# EAGLE design 7s_BMS_V1-1 (EAGLE 9.6.2)
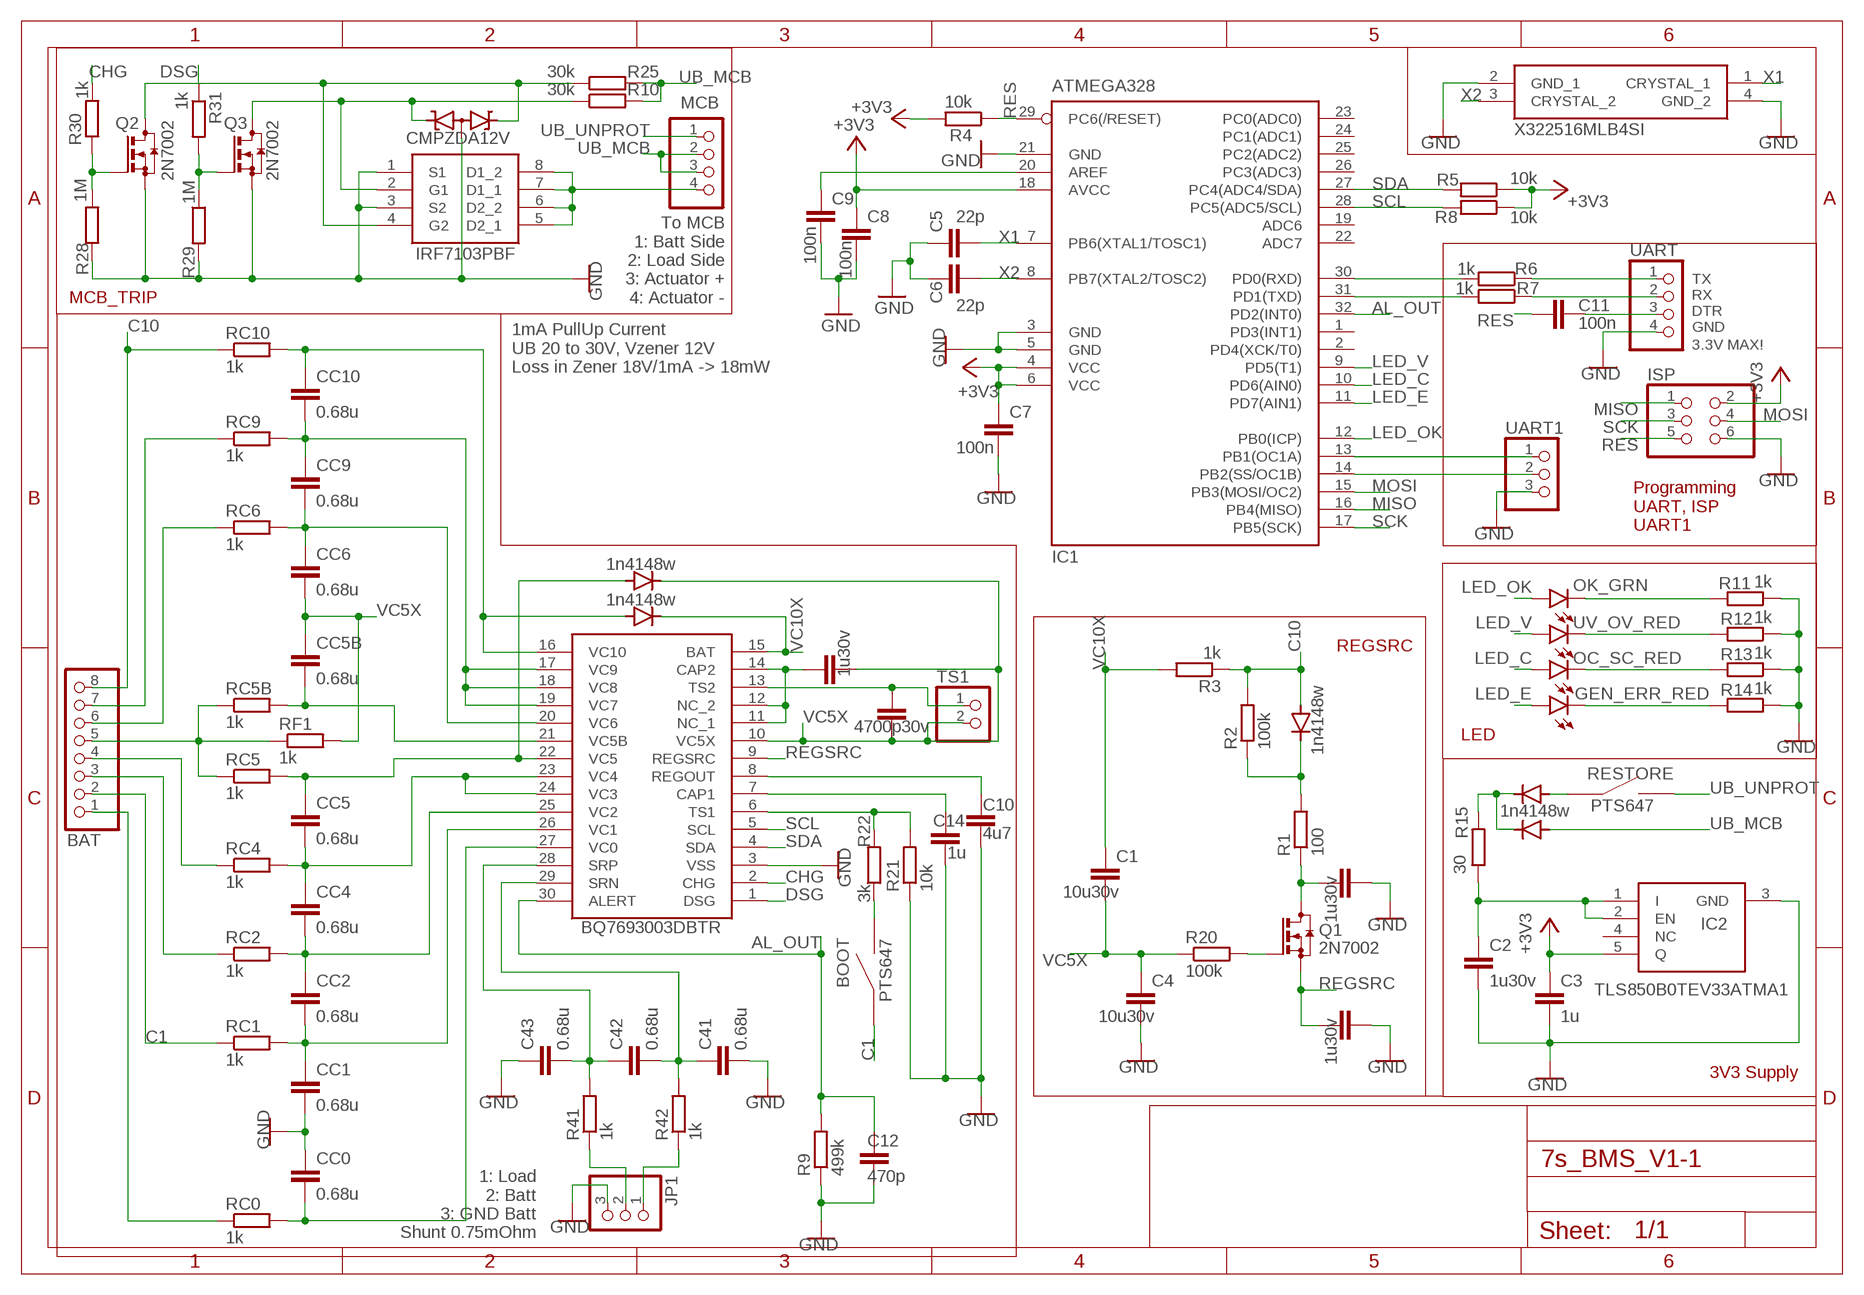
[diagram p0: schematic, sheet 1]

## Parts
BAT  PINHD-1X8/90  [1X08/90]
C1  10u30v  C-EUC0805  [C0805]
C2  1u30v  C-EUC0805  [C0805]
C3  1u  C-EUC0603  [C0603]
C4  10u30v  C-EUC0805  [C0805]
C5  22p  C-EUC0603  [C0603]
C6  22p  C-EUC0603  [C0603]
C7  100n  C-EUC0603  [C0603]
C8  100n  C-EUC0603  [C0603]
C9  100n  C-EUC0603  [C0603]
C10  4u7  C-EUC0805  [C0805]
C11  100n  C-EUC0603  [C0603]
C12  470p  C-EUC0603  [C0603]
C14  1u  C-EUC0603  [C0603]
C30  1u30v  C-EUC0603  [C0603]
C31  1u30v  C-EUC0603  [C0603]
C41  0.68u  C-EUC0603  [C0603]
C42  0.68u  C-EUC0603  [C0603]
C43  0.68u  C-EUC0603  [C0603]
C61  1u30v  C-EUC0603  [C0603]
C62  4700p30v  C-EUC0603  [C0603]
CC0  0.68u  C-EUC0603  [C0603]
CC1  0.68u  C-EUC0603  [C0603]
CC2  0.68u  C-EUC0603  [C0603]
CC4  0.68u  C-EUC0603  [C0603]
CC5  0.68u  C-EUC0603  [C0603]
CC5B  0.68u  C-EUC0603  [C0603]
CC6  0.68u  C-EUC0603  [C0603]
CC9  0.68u  C-EUC0603  [C0603]
CC10  0.68u  C-EUC0603  [C0603]
D1  1n4148w  DIODE-SOD123  [SOD123]
D2  1n4148w  DIODE-SOD123  [SOD123]
D3  1n4148w  DIODE-SOD123  [SOD123]
D4  1n4148w  DIODE-SOD123  [SOD123]
D5  1n4148w  DIODE-SOD123  [SOD123]
GEN_ERR_RED  KT-0603R  LEDCHIP-LED0603  [CHIP-LED0603]
IC1  ATMEGA328  MEGA8-AI  [TQFP32-08]
IC2  TLS850B0TEV33ATMA1  [BTS6143D]
IC3  BQ7693003DBTR  [SOP50P640X120-30N]
ISP  PINHD-2X3  [2X03]
JP1  PINHD-1X3/90  [1X03/90]
MCB  PINHD-1X4  [1X04]
OC_SC_RED  KT-0603R  LEDCHIP-LED0603  [CHIP-LED0603]
OK_GRN  19-217/GHC-YR1S2/3T  LEDCHIP-LED0603  [CHIP-LED0603]
Q1  2N7002  BSS123  [SOT23]
Q2  2N7002  BSS123  [SOT23]
Q3  2N7002  BSS123  [SOT23]
Q4  IRF7103PBF  [SOIC127P600X175-8N]
R1  100  R-EU_R0603  [R0603]
R2  100k  R-EU_R0603  [R0603]
R3  1k  R-EU_R0603  [R0603]
R4  10k  R-EU_R0603  [R0603]
R5  10k  R-EU_R0603  [R0603]
R6  1k  R-EU_R0603  [R0603]
R7  1k  R-EU_R0603  [R0603]
R8  10k  R-EU_R0603  [R0603]
R9  499k  R-EU_R0603  [R0603]
R10  30k  R-EU_R0603  [R0603]
R11  1k  R-EU_R0603  [R0603]
R12  1k  R-EU_R0603  [R0603]
R13  1k  R-EU_R0603  [R0603]
R14  1k  R-EU_R0603  [R0603]
R15  30  R-EU_R0805  [R0805]
R20  100k  R-EU_R0603  [R0603]
R21  10k  R-EU_R0603  [R0603]
R22  3k  R-EU_R0603  [R0603]
R25  30k  R-EU_R0603  [R0603]
R28  1M  R-EU_R0603  [R0603]
R29  1M  R-EU_R0603  [R0603]
R30  1k  R-EU_R0603  [R0603]
R31  1k  R-EU_R0603  [R0603]
R41  1k  R-EU_R0603  [R0603]
R42  1k  R-EU_R0603  [R0603]
RC0  1k  R-EU_R0603  [R0603]
RC1  1k  R-EU_R0603  [R0603]
RC2  1k  R-EU_R0603  [R0603]
RC4  1k  R-EU_R0603  [R0603]
RC5  1k  R-EU_R0603  [R0603]
RC5B  1k  R-EU_R0603  [R0603]
RC6  1k  R-EU_R0603  [R0603]
RC9  1k  R-EU_R0603  [R0603]
RC10  1k  R-EU_R0603  [R0603]
RF1  1k  R-EU_R0603  [R0603]
TS1  PINHD-1X2/90  [1X02/90]
U$1  PTS647  [PTS647]
U$2  PTS647  [PTS647]
U$3  CMPZDA12V  [SOT23]
UART  PINHD-1X4  [1X04]
UART1  PINHD-1X3  [1X03]
UV_OV_RED  KT-0603R  LEDCHIP-LED0603  [CHIP-LED0603]
Y1  X322516MLB4SI  [X322516MLB4SI]

## Nets
+3V3: C3.1 C7.1 C8.1 IC1.4(VCC) IC1.6(VCC) IC1.18(AVCC) IC2.5(Q) ISP.2 R4.2 R5.1 R8.1
A: BAT.5 RC5.1 RC5B.1 RF1.1
AL_OUT: C12.1 IC1.32(PD2(INT0)) IC3.30(ALERT) R9.2
C1: BAT.2 RC1.1 U$2.1 U$2.2
C10: BAT.8 D5.A R2.2 R3.1 RC10.1
CHG: IC3.2(CHG) R30.2
DSG: IC3.1(DSG) R31.1
GND: C2.2 C3.2 C4.2 C5.1 C6.1 C7.2 C8.2 C9.2 C10.2 C12.2 C14.2 C30.1 C31.1 C41.2 C43.1 CC0.1 CC1.2 IC1.3(GND) IC1.5(GND) IC1.21(GND) IC2.3(GND) IC3.3(VSS) ISP.6 JP1.3 Q2.2(S) Q3.2(S) Q4.1(S1) Q4.3(S2) R9.1 R11.1 R12.1 R13.1 R14.1 R21.1 R28.1 R29.2 U$3.3(A) UART1.3 UART.4 Y1.2(GND_1) Y1.4(GND_2)
LED_C: IC1.10(PD6(AIN0)) OC_SC_RED.A
LED_E: GEN_ERR_RED.A IC1.11(PD7(AIN1))
LED_OK: IC1.12(PB0(ICP)) OK_GRN.A
LED_V: IC1.9(PD5(T1)) UV_OV_RED.A
MISO: IC1.16(PB4(MISO)) ISP.1
MOSI: IC1.15(PB3(MOSI/OC2)) ISP.4
N$1: C2.1 IC2.1(I) IC2.2(EN) R15.1
N$2: CC10.1 D3.A IC3.16(VC10) RC10.2
N$3: D2.A U$1.1 U$1.2
N$4: C30.2 Q1.3(D) R1.1
N$5: CC0.2 IC3.27(VC0) RC0.2
N$6: C61.1 IC3.11(NC_1) IC3.12(NC_2) IC3.14(CAP2)
N$7: CC1.1 CC2.2 IC3.26(VC1) RC1.2
N$8: CC2.1 CC4.2 IC3.25(VC2) RC2.2
N$9: CC4.1 CC5.2 IC3.23(VC4) IC3.24(VC3) RC4.2
N$10: BAT.1 RC0.1
N$11: BAT.4 RC4.1
N$12: IC1.30(PD0(RXD)) R6.2
N$13: C9.1 IC1.20(AREF)
N$14: BAT.3 RC2.1
N$15: IC1.31(PD1(TXD)) R7.2
N$16: R6.1 UART.1
N$17: R7.1 UART.2
N$18: C11.2 UART.3
N$19: C42.1 C43.2 IC3.28(SRP) R41.2
N$20: CC5.1 D4.A IC3.22(VC5) RC5.2
N$21: CC5B.2 IC3.21(VC5B) RC5B.2
N$22: BAT.7 RC9.1
N$23: BAT.6 RC6.1
N$24: CC9.1 CC10.2 IC3.17(VC9) IC3.18(VC8) IC3.19(VC7) RC9.2
N$25: CC6.1 CC9.2 IC3.20(VC6) RC6.2
N$26: C62.2 IC3.13(TS2) TS1.1
N$27: Q1.1(G) R20.2
N$28: C10.1 IC3.8(REGOUT)
N$29: D5.C R1.2 R2.1
N$30: C14.1 IC3.7(CAP1)
N$31: IC3.6(TS1) R21.2 R22.2
N$32: R22.1 U$2.3 U$2.4
N$33: C41.1 C42.2 IC3.29(SRN) R42.2
N$34: JP1.2 R41.1
N$35: JP1.1 R42.1
N$36: Q2.1(G) R28.2 R30.1
N$37: Q3.1(G) R29.1 R31.2
N$38: MCB.4 Q4.5(D2_1) Q4.6(D2_2) Q4.7(D1_1) Q4.8(D1_2)
N$39: D1.C D2.C R15.2
N$40: Q3.3(D) Q4.2(G1) R10.1 U$3.1(K2)
N$41: GEN_ERR_RED.C R14.2
N$42: OC_SC_RED.C R13.2
N$43: R12.2 UV_OV_RED.C
N$44: OK_GRN.C R11.2
N$45: IC1.14(PB2(SS/OC1B)) UART1.2
N$46: IC1.13(PB1(OC1A)) UART1.1
REGSRC: C31.2 IC3.9(REGSRC) Q1.2(S)
RES: C11.1 IC1.29(PC6(/RESET)) ISP.5 R4.1
SCK: IC1.17(PB5(SCK)) ISP.3
SCL: IC1.28(PC5(ADC5/SCL)) IC3.5(SCL) R8.2
SDA: IC1.27(PC4(ADC4/SDA)) IC3.4(SDA) R5.2
TRIP_MCB: Q2.3(D) Q4.4(G2) R25.1 U$3.2(K1)
UB_MCB: D1.A MCB.2 MCB.3 R10.2 R25.2
UB_UNPROT: MCB.1 U$1.3 U$1.4
VC5X: C1.2 C4.1 C61.2 C62.1 CC5B.1 CC6.2 D4.C IC3.10(VC5X) R20.1 RF1.2 TS1.2
VC10X: C1.1 D3.C IC3.15(BAT) R3.2
X1: C5.2 IC1.7(PB6(XTAL1/TOSC1)) Y1.1(CRYSTAL_1)
X2: C6.2 IC1.8(PB7(XTAL2/TOSC2)) Y1.3(CRYSTAL_2)
Unconnected: IC1.1(PD3(INT1)) IC1.2(PD4(XCK/T0)) IC1.19(ADC6) IC1.22(ADC7) IC1.23(PC0(ADC0)) IC1.24(PC1(ADC1)) IC1.25(PC2(ADC2)) IC1.26(PC3(ADC3)) IC2.4(NC)

## Notes on the sheet
- MCB_TRIP
- To MCB
  1: Batt Side
  2: Load Side
  3: Actuator +
  4: Actuator -
- TX
  RX
  DTR
  GND
- 3.3V MAX!
- 1mA PullUp Current
  UB 20 to 30V, Vzener 12V
  Loss in Zener 18V/1mA -> 18mW
- Programming
  UART, ISP
  UART1
- REGSRC
- LED
- RESTORE
- BOOT
- 3V3 Supply
- 1: Load
  2: Batt
  3: GND Batt
  Shunt 0.75mOhm

## Library data of the parts
BAT = pinhead:PINHD-1X8: PIN HEADER
C1-C12 C14 C30 C31 C41-C43 C61 C62 CC0 CC1 CC2 CC4 CC5 CC5B CC6 CC9 CC10 = rcl:C-EU: CAPACITOR, European symbol; SPICEPREFIX: C
D1-D5 = diode:DIODE-: DIODE
GEN_ERR_RED OC_SC_RED OK_GRN UV_OV_RED = led:LED: LED OSRAM: - CHIPLED LG R971, LG N971, LY N971, LG Q971, LY Q971, LO R971, LY R971 LH N974, LH R974 LS Q976, LO Q976, LY Q976 LO Q996 - Hyper CHIPLED LW Q18S LB Q993, LB Q99A, LB R99A - SideLED LS A670, LO A670, LY A670, LG A670, LP A670 LB A673, LV A673, LT A673, LW A673 LH A674 LY A675 LS A676, LA A676, LO A676, LY A676, LW A676 LS A679, LY A679, LG A679 - Hyper Micro SIDELED® LS Y876, LA Y876, LO Y876, LY Y876 LT Y87S - SmartLED LW L88C, LW L88S LB L89C, LB L89S, LG L890 LS L89K, LO L89K, LY L89K LS L896, LA L896, LO L896, LY L896 - TOPLED LS T670, LO T670, LY T670, LG T670, LP T670 LSG T670, LSP T670, LSY T670, LOP T670, LYG T670 LG T671, LOG T671, LSG T671 LB T673, LV T673, LT T673, LW T673 LH T674 LS T676, LA T676, LO T676, LY T676, LB T676, LH T676, LSB T676, LW T676 LB T67C, LV T67C, LT T67C, LS T67K, LO T67K, LY T67K, LW E67C LS E67B, LA E67B, LO E67B, LY E67B, LB E67C, LV E67C, LT E67C LW T67C LS T679, LY T679, LG T679 LS T770, LO T770, LY T770, LG T770, LP T770 LB T773, LV T773, LT T773, LW T773 LH T774 LS E675, LA E675, LY E675, LS T675 LS T776, LA T776, LO T776, LY T776, LB T776 LHGB T686 LT T68C, LB T68C - Hyper Mini TOPLED® LB M676 - Mini TOPLED Santana® LG M470 LS M47K, LO M47K, LY M47K Source: http://www.osram.convergy.de LUXEON: - LUMILED® LXK2-PW12-R00, LXK2-PW12-S00, LXK2-PW14-U00, LXK2-PW14-V00 LXK2-PM12-R00, LXK2-PM12-S00, LXK2-PM14-U00 LXK2-PE12-Q00, LXK2-PE12-R00, LXK2-PE12-S00, LXK2-PE14-T00, LXK2-PE14-U00 LXK2-PB12-K00, LXK2-PB12-L00, LXK2-PB12-M00, LXK2-PB14-N00, LXK2-PB14-P00, LXK2-PB14-Q00 LXK2-PR12-L00, LXK2-PR12-M00, LXK2-PR14-Q00, LXK2-PR14-R00 LXK2-PD12-Q00, LXK2-PD12-R00, LXK2-PD12-S00 LXK2-PH12-R00, LXK2-PH12-S00 LXK2-PL12-P00, LXK2-PL12-Q00, LXK2-PL12-R00 Source: www.luxeon.com KINGBRIGHT: KA-3528ASYC Source: www.kingbright.com
IC1 = atmel:MEGA8: MICROCONTROLLER 8 Kbytes FLASH, 1 kbytes SRAM, 512 bytes EEPROM, USART, 6-channel 10 bit ADC, 2-channel 8 bit ADC Pin compatible with Atmega48, ATMega88, ATMega168 Source: avr.lbr; MPN: ATMEGA8-16AU; OC_FARNELL: 9171371; OC_NEWARK: 73M8863
IC2 = TLS850B0TEV33ATMA1:TLS850B0TEV33ATMA1: Linear Voltage Regulators LINEAR VOLTAGE REGULATOR Source: Datasheet <https://componentsearchengine.com/Datasheets/1/TLS850B0TEV33ATMA1.pdf>; ARROW_PART_NUMBER: TLS850B0TEV33ATMA1; ARROW_PRICE-STOCK: https://www.arrow.com/en/products/tls850b0tev33atma1/infineon-technologies-ag; DESCRIPTION: Linear Voltage Regulators LINEAR VOLTAGE REGULATOR; HEIGHT: 2mm; MANUFACTURER_NAME: Infineon; MANUFACTURER_PART_NUMBER: TLS850B0TEV33ATMA1; MOUSER_PART_NUMBER: 726-TLS850B0TEV33ATM; MOUSER_PRICE-STOCK: https://www.mouser.co.uk/ProductDetail/Infineon-Technologies/TLS850B0TEV33ATMA1/?qs=W0yvOO0ixfGvA2FkIMPoCw%3D%3D
IC3 = BQ7693003DBTR:BQ7693003DBTR: 6 to 10-Series Cell Li-Ion and Li-Phosphate Battery Monitor (bq76940 Family) Source: Datasheet <http://www.ti.com/lit/gpn/bq76930>; ARROW_PART_NUMBER: BQ7693003DBTR; ARROW_PRICE-STOCK: https://www.arrow.com/en/products/bq7693003dbtr/texas-instruments; DESCRIPTION: 6 to 10-Series Cell Li-Ion and Li-Phosphate Battery Monitor (bq76940 Family); HEIGHT: 1.2mm; MANUFACTURER_NAME: Texas Instruments; MANUFACTURER_PART_NUMBER: BQ7693003DBTR; MOUSER_PART_NUMBER: 595-BQ7693003DBTR; MOUSER_PRICE-STOCK: https://www.mouser.co.uk/ProductDetail/Texas-Instruments/BQ7693003DBTR?qs=%2Fd%252BFzHvH4c12hO1yCMa7%252Bw%3D%3D
ISP = pinhead:PINHD-2X3: PIN HEADER
JP1 UART1 = pinhead:PINHD-1X3: PIN HEADER
MCB UART = pinhead:PINHD-1X4: PIN HEADER
Q1-Q3 = transistor-small-signal:BSS123: N-CHANNEL MOS FET
Q4 = IRF7103PBF:IRF7103PBF: MOSFET Dual N-Channel 50V 3A SOIC8 International Rectifier IRF7103PBF Dual N-channel MOSFET Transistor, 3 A, 50 V, 8-Pin SOIC Source: Datasheet <http://www.infineon.com/dgdl/irf7103pbf.pdf?fileId=5546d462533600a4015355f0f0141ac6>; ARROW_PART_NUMBER: IRF7103PBF; DESCRIPTION: MOSFET Dual N-Channel 50V 3A SOIC8 International Rectifier IRF7103PBF Dual N-channel MOSFET Transistor, 3 A, 50 V, 8-Pin SOIC; HEIGHT: 1.75mm; MANUFACTURER_NAME: International Rectifier; MANUFACTURER_PART_NUMBER: IRF7103PBF
R1-R15 R20-R22 R25 R28-R31 R41 R42 RC0 RC1 RC2 RC4 RC5 RC5B RC6 RC9 RC10 RF1 = rcl:R-EU_: RESISTOR, European symbol; SPICEPREFIX: R
TS1 = pinhead:PINHD-1X2: PIN HEADER
U$1 U$2 = smd_taster:PTS647
U$3 = diode_zener_added:CMPZDA12V
Y1 = X322516MLB4SI:X322516MLB4SI: Crystal Source: Datasheet <https://datasheet.lcsc.com/szlcsc/Yangxing-Tech-X322516MLB4SI_C13738.pdf>; DESCRIPTION: Crystal; HEIGHT: 0.8mm; MANUFACTURER_NAME: Yangxing Tech; MANUFACTURER_PART_NUMBER: X322516MLB4SI

## Board
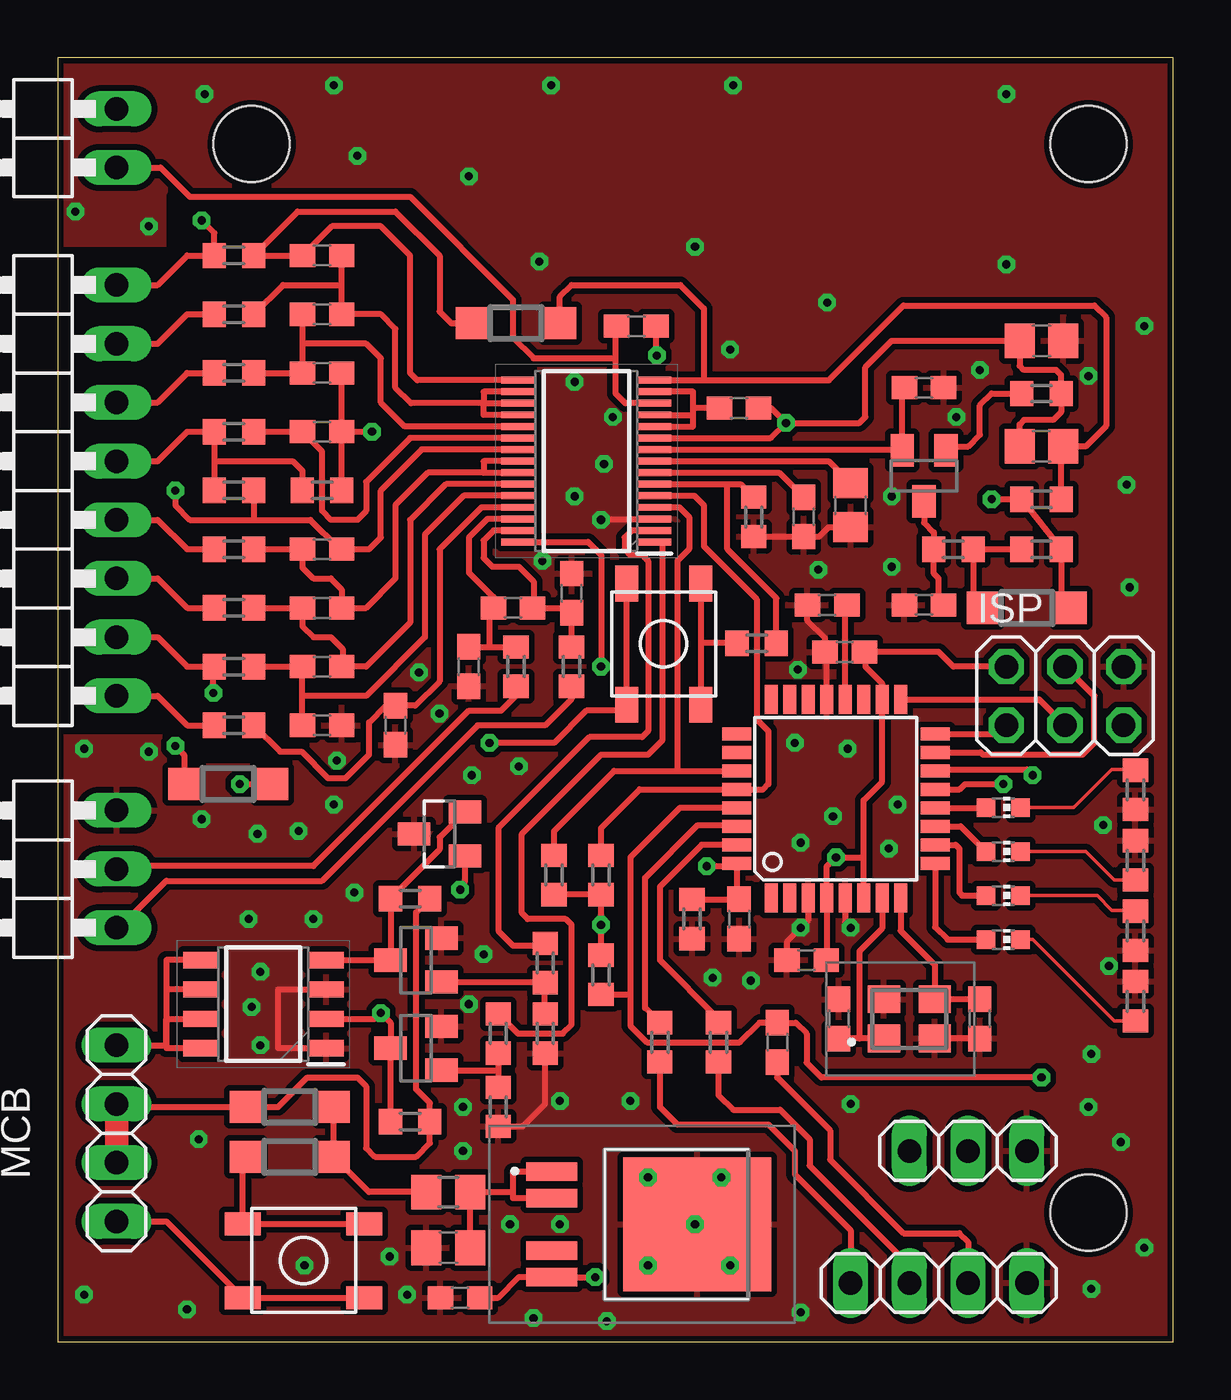
[diagram p1: board, top side]
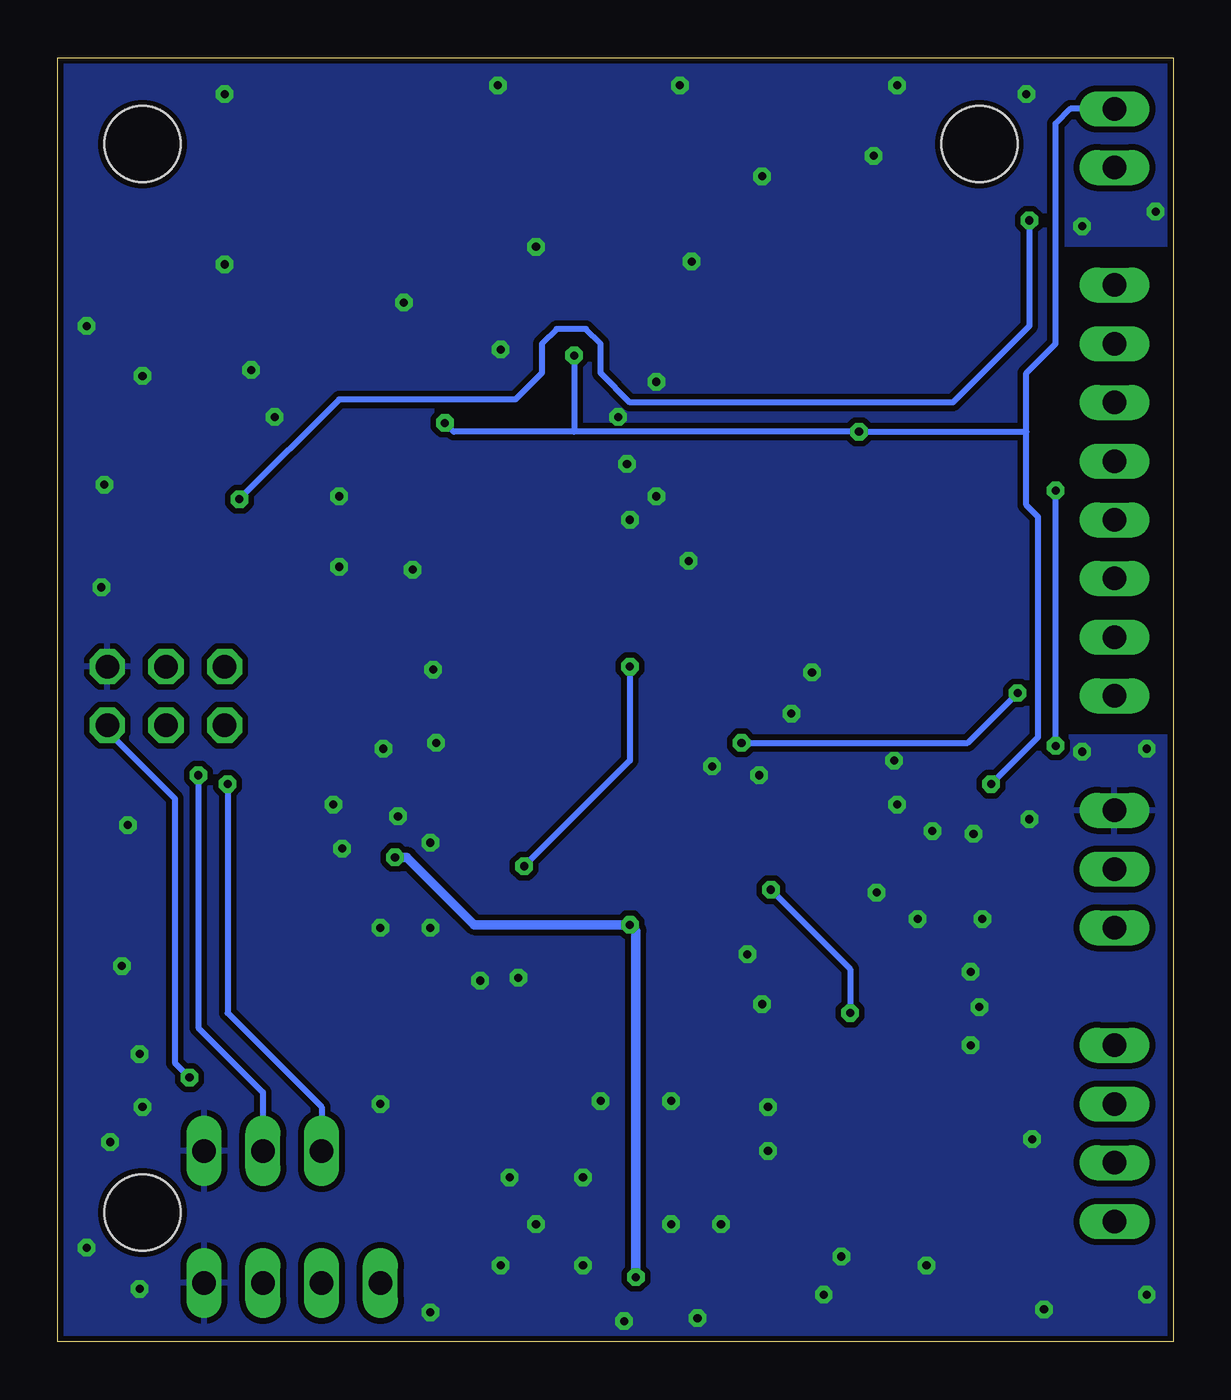
[diagram p2: board, bottom side, seen from below]

Size 48.24 x 55.55 mm. Coordinates in mm from the lower left corner, seen from the top.
Outline: 0,0 48.24,0 48.24,55.55 0,55.55 0,0
Copper layers (1*16): Top 0.035mm / dielectric 1.5mm / Bottom 0.035mm
Design rules "jlcpcb": minimum track width 3.5mil, minimum drill 0.2mm, track to track 3.5mil, track to pad 5mil, pad to pad 5mil, via to via 5mil, smd to smd 5mil, copper to edge 0.2mm, drill to drill 8mil, minimum pad ring 10mil, minimum via ring 8mil, stop-mask expansion 4mil, vias tented up to drill 0mil, thermal gap 10mil
Holes 3.3 mm at 44.58,51.82 8.38,51.82 44.58,5.59
tRestrict: area 0,25.4 to 8.9,49.5
bRestrict: area 0,26.7 to 5.1,47

### Footprints (pad centres in the part's own frame; a part is rotated, then mirrored left to right if it is on the bottom)
1X08/90 = drill 1.016 long: 1 -8.89,-3.81; 2 -6.35,-3.81; 3 -3.81,-3.81; 4 -1.27,-3.81; 5 1.27,-3.81; 6 3.81,-3.81; 7 6.35,-3.81; 8 8.89,-3.81
C0805 = smd 1.3 x 1.5: 1 -0.95,0; 2 0.95,0
C0603 = smd 1.1 x 1: 1 -0.85,0; 2 0.85,0
SOD123 = smd 1.4 x 1.4: A 1.9,0; C -1.9,0
CHIP-LED0603 = smd 0.8 x 0.8: A 0,-0.75; C 0,0.75
TQFP32-08 = smd 1.27 x 0.559: 1 -4.293,2.8; 2 -4.293,2; 3 -4.293,1.2; 4 -4.293,0.4; 5 -4.293,-0.4; 6 -4.293,-1.2; 7 -4.293,-2; 8 -4.293,-2.8; 17 4.293,-2.8; 18 4.293,-2; 19 4.293,-1.2; 20 4.293,-0.4; 21 4.293,0.4; 22 4.293,1.2; 23 4.293,2; 24 4.293,2.8 | smd 0.559 x 1.27: 9 -2.8,-4.293; 10 -2,-4.293; 11 -1.2,-4.293; 12 -0.4,-4.293; 13 0.4,-4.293; 14 1.2,-4.293; 15 2,-4.293; 16 2.8,-4.293; 25 2.8,4.293; 26 2,4.293; 27 1.2,4.293; 28 0.4,4.293; 29 -0.4,4.293; 30 -1.2,4.293; 31 -2,4.293; 32 -2.8,4.293
BTS6143D = smd 0.8 x 2.2: 1 -2.28,-3.4; 2 -1.14,-3.4; 4 1.14,-3.4; 5 2.28,-3.4 | smd 5.8 x 6.4: 3 0,2.9
SOP50P640X120-30N = smd 1.475 x 0.3: 1 -2.938,3.5; 2 -2.938,3; 3 -2.938,2.5; 4 -2.938,2; 5 -2.938,1.5; 6 -2.938,1; 7 -2.938,0.5; 8 -2.938,0; 9 -2.938,-0.5; 10 -2.938,-1; 11 -2.938,-1.5; 12 -2.938,-2; 13 -2.938,-2.5; 14 -2.938,-3; 15 -2.938,-3.5; 16 2.938,-3.5; 17 2.938,-3; 18 2.938,-2.5; 19 2.938,-2; 20 2.938,-1.5; 21 2.938,-1; 22 2.938,-0.5; 23 2.938,0; 24 2.938,0.5; 25 2.938,1; 26 2.938,1.5; 27 2.938,2; 28 2.938,2.5; 29 2.938,3; 30 2.938,3.5
2X03 = drill 1.016 octagon: 1 -2.54,-1.27; 2 -2.54,1.27; 3 0,-1.27; 4 0,1.27; 5 2.54,-1.27; 6 2.54,1.27
1X03/90 = drill 1.016 long: 1 -2.54,-3.81; 2 0,-3.81; 3 2.54,-3.81
1X04 = drill 1.016 long: 1 -3.81,0; 2 -1.27,0; 3 1.27,0; 4 3.81,0
SOT23 = smd 1 x 1.4: 1 -0.95,-1.1; 2 0.95,-1.1; 3 0,1.1
SOIC127P600X175-8N = smd 1.525 x 0.7: 1 -2.712,1.905; 2 -2.712,0.635; 3 -2.712,-0.635; 4 -2.712,-1.905; 5 2.712,-1.905; 6 2.712,-0.635; 7 2.712,0.635; 8 2.712,1.905
R0603 = smd 1 x 1.1: 1 -0.85,0; 2 0.85,0
R0805 = smd 1.3 x 1.5: 1 -0.95,0; 2 0.95,0
1X02/90 = drill 1.016 long: 1 -1.27,-3.81; 2 1.27,-3.81
PTS647 = smd 1.55 x 1: 1 -0.381,3.835; 2 4.869,3.835; 3 -0.381,0.635; 4 4.869,0.635
1X03 = drill 1.016 long: 1 -2.54,0; 2 0,0; 3 2.54,0
X322516MLB4SI = smd 1.4 x 1.2: 1 -1.1,-0.85; 2 1.1,-0.85; 3 1.1,0.85; 4 -1.1,0.85

### Placement (x,y rotation side)
BAT  -1.27,36.83 90 top
C1  42.55,38.73 180 top
C2  16.89,4.06 180 top
C3  17.4,1.91 180 top
C4  42.55,43.31 0 top
C5  33.78,13.97 270 top
C6  39.88,13.97 90 top
C7  32.38,16.51 180 top
C8  34.04,29.85 180 top
C9  33.27,31.88 180 top
C10  34.29,36.2 270 top
C11  31.11,12.95 270 top
C12  29.46,18.29 270 top
C14  32.26,35.69 270 top
C30  37.47,31.88 0 top
C31  37.47,41.27 180 top
C41  22.23,32.38 90 top
C42  19.68,31.75 0 top
C43  17.78,29.21 90 top
C61  29.46,40.39 0 top
C62  25.02,43.94 180 top
CC0  14.61,26.67 90 top
CC1  11.43,26.67 0 top
CC2  11.43,29.21 180 top
CC4  11.43,31.75 180 top
CC5  11.43,34.29 180 top
CC5B  11.43,39.37 180 top
CC6  11.43,41.91 0 top
CC9  11.43,44.45 180 top
CC10  11.43,46.99 0 top
D1  10.03,10.16 180 top
D2  10.03,8 180 top
D3  19.81,44.07 180 top
D4  7.37,24.13 180 top
D5  41.91,31.75 0 top
GEN_ERR_RED  40.89,21.21 270 top
IC1  33.66,23.5 90 top
IC2  24.77,5.08 270 top
IC3  22.86,38.1 180 top
ISP  43.56,27.94 0 top
JP1  -1.27,20.45 90 top
MCB  2.54,9.02 90 top
OC_SC_RED  40.89,19.3 270 top
OK_GRN  40.89,23.11 270 top
Q1  37.47,37.46 180 top
Q2  15.49,16.51 90 top
Q3  15.49,12.7 90 top
Q4  8.89,14.61 180 top
R1  38.73,34.29 0 top
R2  42.55,34.29 0 top
R3  42.55,36.45 0 top
R4  23.5,15.88 90 top
R5  21.46,20.19 90 top
R6  26.04,12.95 90 top
R7  28.57,12.95 90 top
R8  23.5,20.19 90 top
R9  27.43,18.29 90 top
R10  15.24,9.53 0 top
R11  46.61,23.88 90 top
R12  46.61,14.73 270 top
R13  46.61,17.78 90 top
R14  46.61,20.83 270 top
R15  16.89,6.48 180 top
R20  42.55,41.02 180 top
R21  30.1,35.69 90 top
R22  30.23,30.23 0 top
R25  15.24,19.18 0 top
R28  21.08,13.34 90 top
R29  19.05,10.16 270 top
R30  21.08,16.38 90 top
R31  19.05,13.34 270 top
R41  19.81,29.21 90 top
R42  22.23,29.21 90 top
RC0  7.62,26.67 0 top
RC1  7.62,29.21 0 top
RC2  7.62,31.75 0 top
RC4  7.62,34.29 0 top
RC5  7.62,36.83 0 top
RC5B  7.62,39.37 0 top
RC6  7.62,41.91 0 top
RC9  7.62,44.45 0 top
RC10  7.62,46.99 0 top
RF1  11.43,36.83 0 top
TS1  -1.27,52.07 90 top
U$1  8.38,1.27 0 top
U$2  28.45,27.94 90 top
U$3  16.51,21.97 90 top
UART  38.1,2.54 0 top
UART1  39.37,8.26 0 top
UV_OV_RED  40.89,17.4 270 top
Y1  36.83,13.97 0 top

### Tracks (layer width: path | path; a pad name or v marks a point on that pad's centre or on a via)
+3V3  (via drill 0.35)
  Top 0.254: C7.1 33.26,16.53 IC1.4 33.26,20.55 v33.66,20.96 34.85,20.96 | IC1.6 34.85,20.96 | 34.85,20.96 34.85,23.43 35.66,24.23 IC1.18 35.66,28.48 34.92,29.21 34.92,29.81 C8.1 38.1,29.85 38.73,29.21 ISP.2 | R5.1 R8.1 v23.5,18.03 R4.2 | C3.1 19.05,1.91 19.95,2.8 IC2.5 v23.24,2.79
  Bottom 0.406: v23.24,2.79 23.24,17.78 v23.5,18.03 30.23,18.03 33.15,20.96 v33.66,20.96
A
  Top 0.254: BAT.5 4.32,38.1 5.59,39.37 RC5B.1 6.77,38.1 | 6.77,38.1 RC5.1 | 6.77,38.1 10.16,38.1 10.58,37.68 RF1.1
AL_OUT  (via drill 0.35)
  Top 0.254: R9.2 C12.1 29.36,19.24 IC1.32 29.24,20.57 v28.07,20.57 | IC3.30 22.93,34.6 23.5,34.04 v23.5,29.21
  Bottom 0.254: v23.5,29.21 23.5,25.15 v28.07,20.57
C1  (via drill 0.35)
  Top 0.254: BAT.2 4.32,30.48 5.59,29.21 RC1.1 6.73,29.17 v6.73,28.07 | U$2.2 U$2.1 24.36,27.3 22.86,27.3 21.46,25.91 v18.67,25.91
  Bottom 0.254: v18.67,25.91 8.89,25.91 v6.73,28.07
C10  (via drill 0.35)
  Top 0.254: BAT.8 4.32,45.72 5.59,46.99 RC10.1 6.77,47.97 v6.22,48.51 | D5.A 43.4,32.16 R2.2 R3.1 v40.39,36.45
  Bottom 0.254: v6.22,48.51 6.22,43.94 9.53,40.64 23.5,40.64 24.77,41.91 24.77,43.18 25.4,43.81 26.67,43.81 27.3,43.18 27.3,41.91 28.45,40.77 36.07,40.77 v40.39,36.45
CHG
  Top 0.254: IC3.2 24.81,35.1 24.51,34.8 24.51,34.29 24.77,34.04 25.27,34.04 25.53,33.78 25.53,26.42 25.27,26.16 22.99,26.16 19.05,22.23 19.05,17.78 19.68,17.14 20.99,17.14 R30.2
DSG
  Top 0.254: IC3.1 26.16,34.6 26.16,26.04 25.53,25.4 23.5,25.4 20.07,21.97 20.07,18.54 20.32,18.29 21.97,18.29 22.23,18.03 22.23,13.72 21.84,13.34 19.9,13.34 R31.1
GND  (via drill 0.35)
  Top 0.254: IC1.3 32.45,18.23 31.54,17.31 C7.2 | IC1.21 33.26,29.78 C8.2 33.19,30.44 32.42,31.2 C9.2 | C6.1 Y1.2 37.68,13.12 | 35.98,14.82 Y1.4 | IC1.5 34.05,18.14 v34.29,17.91 | R21.1 C14.2 32.93,34.84 33.34,35.24 C10.2 | R29.2 20.11,9.31 21.08,10.29 R28.1 | Q4.1 9.53,12.7 9.53,15.24 Q4.3 | v23.5,35.56 23.54,35.6 IC3.3
  other vias: 44.58,41.78 39.88,42.04 8.76,16 8.76,12.83 8.38,14.48 31.88,25.91 32.13,21.59 34.16,25.65 33.53,22.73 35.94,21.34 36.32,23.24 22.35,36.58 23.62,37.97 22.35,41.53 24,40 20.95,33.78 15.62,28.96 6.22,22.61 8.64,21.97 10.41,22.1 19.94,24.89 17.91,24.51 12.83,19.43 11.05,18.29 8.26,18.29 3.94,25.53 1.14,25.65 1.14,2.03 5.59,1.4 10.67,3.3 20.57,1.02 23.75,0.89 25.53,7.11 28.7,7.11 25.53,3.3 29.08,3.3 27.56,5.08 32.13,1.27 46.35,32.64 46.23,37.08 46.99,43.94 41.02,53.97 29.08,42.93 27.56,47.37 11.94,54.36 12.95,51.31 29.21,54.36 32.89,33.4 36.07,33.53 36.07,36.58 38.86,40 28.32,15.75 29.97,15.62 34.29,10.29 18.41,16.76 17.78,14.61 17.53,10.16 17.53,8.26 6.1,8.76 3.94,48.26 6.35,53.97 16.51,27.18 32.13,17.91 14.35,3.68 15.11,2.03 19.56,5.08 21.72,5.08 21.72,10.41 24.77,10.41 45.47,16.26 45.21,22.35 44.7,12.45 45.97,8.64 44.7,2.29 46.99,4.06 44.58,10.16 32,29.08 11.94,23.24 12.06,25.15 0.76,48.89 20.83,46.74 17.78,50.42 33.27,44.96 21.34,54.36 41.02,46.61
  pour Top (isolate 0.254): 0,55.88 0,0 48.26,0 48.26,55.88
  pour Bottom (isolate 0.254): 0,55.88 0,0 48.26,0 48.26,55.88
LED_C
  Top 0.254: IC1.10 38.83,21.5 38.99,21.34 38.99,19.43 39.12,19.3 OC_SC_RED.A
LED_E
  Top 0.254: IC1.11 39.05,22.3 GEN_ERR_RED.A
LED_OK
  Top 0.254: IC1.12 40.12,23.09 OK_GRN.A
LED_V
  Top 0.254: IC1.9 37.95,17.93 38.48,17.4 UV_OV_RED.A
MISO
  Top 0.254: IC1.16 40.65,26.3 ISP.1
MOSI
  Top 0.254: IC1.15 39.91,25.5 40.01,25.4 44.32,25.4 44.83,25.91 44.83,27.94 ISP.4
N$1
  Top 0.254: C2.1 R15.1 19.68,6.48 | IC2.2 19.68,6.22 19.68,6.35 19.68,6.48 | IC2.1 19.68,7.36 19.68,6.48
N$2
  Top 0.254: IC3.16 15.55,41.6 15.24,41.91 15.24,46.99 13.97,48.26 11.85,48.26 CC10.1 RC10.2 10.38,48.89 14.61,48.89 16.51,46.99 16.51,44.58 17.02,44.07 D3.A
N$3
  Top 0.254: U$1.2 U$1.1 8,7.87 D2.A
N$4
  Top 0.254: C30.2 38.1,32.09 38.1,33.02 37.88,33.23 R1.1 37.88,35.01 37.47,35.43 Q1.3
N$5
  Top 0.254: IC3.27 18.32,36.1 16.51,34.29 16.51,28.57 15.46,27.52 CC0.2 14.19,27.52 13.46,26.8 13.46,25.4 12.45,24.38 11.68,24.38 10.54,25.53 9.61,25.53 RC0.2
N$6
  Top 0.254: IC3.14 27.48,41.1 27.48,40.39 | IC3.11 27.48,39.6 27.48,40.1 | 27.48,40.1 27.48,40.39 | IC3.12 27.48,40.1 | C61.1 27.48,40.39
N$7
  Top 0.254: RC1.2 CC2.2 10.58,27.94 | CC1.1 10.58,27.94 | 10.58,27.94 13.34,27.94 15.88,30.48 15.88,34.92 17.55,36.6 IC3.26
N$8
  Top 0.254: RC2.2 CC4.2 10.58,30.95 11.05,30.48 11.81,30.48 12.32,29.97 12.32,29.25 | 12.32,29.25 CC2.1 | 12.32,29.25 12.36,29.21 13.34,29.21 15.24,31.12 15.24,35.56 16.78,37.1 IC3.25
N$9
  Top 0.254: RC4.2 CC5.2 10.58,33.49 11.05,33.02 11.81,33.02 12.28,32.55 CC4.1 13.34,31.75 14.61,33.02 14.61,36.2 16.01,37.6 18.41,37.6 | 18.41,37.6 IC3.24 | IC3.23 18.41,38.1 18.41,37.6
N$10
  Top 0.254: BAT.1 4.32,27.94 5.59,26.67 RC0.1
N$11
  Top 0.254: BAT.4 4.32,35.56 5.59,34.29 RC4.1
N$12
  Top 0.254: IC1.30 29.3,22.35 27.69,22.35 25.4,20.07 25.4,14.44 R6.2
N$13
  Top 0.254: IC1.20 34.05,31.81 C9.1
N$14
  Top 0.254: BAT.3 4.32,33.02 5.59,31.75 RC2.1
N$15
  Top 0.254: R7.2 28.57,13.97 26.04,16.51 26.04,19.68 27.84,21.5 IC1.31
N$16
  Top 0.254: R6.1 26.04,10.16 26.8,9.4 30.73,9.4 31.88,8.26 31.88,7.24 34.29,4.83 UART.1
N$17
  Top 0.254: R7.1 28.57,10.67 29.21,10.03 31.24,10.03 32.51,8.76 32.51,7.62 36.83,3.3 UART.2
N$18
  Top 0.254: C11.2 31.11,11.43 33.4,9.14 33.4,7.87 36.58,4.7 38.99,4.7 39.37,4.32 UART.3
N$19
  Top 0.254: IC3.28 18.58,35.6 17.78,34.8 17.78,33.27 18.84,32.22 C42.1 18.67,31.75 18.67,30.06 | C43.2 18.67,30.06 | 18.67,30.06 R41.2
N$20  (via drill 0.35)
  Top 0.254: IC3.22 15.74,38.6 13.97,36.83 13.97,34.8 13.46,34.29 CC5.1 12.32,34.33 12.15,34.33 10.92,35.56 8.51,35.56 | RC5.2 8.47,35.6 8.51,35.56 | v5.08,36.83 5.08,36.2 5.71,35.56 8.51,35.56 | v5.08,25.78 5.47,25.39 D4.A
  Bottom 0.254: v5.08,25.78 v5.08,36.83
N$21
  Top 0.254: RC5B.2 CC5B.2 11.43,38.52 11.43,35.94 11.81,35.56 12.95,35.56 13.34,35.94 13.34,37.2 15.24,39.1 IC3.21
N$22
  Top 0.254: BAT.7 4.32,43.18 5.59,44.45 RC9.1
N$23
  Top 0.254: BAT.6 4.32,40.64 5.59,41.91 RC6.1
N$24
  Top 0.254: RC9.2 9.74,45.72 12.28,45.72 | 18.41,40.6 IC3.18 | IC3.17 18.41,41.1 18.41,40.6 | IC3.19 18.41,40.1 18.41,40.6 | 18.41,40.6 15.28,40.6 14.61,41.27 14.61,43.81 13.97,44.45 CC9.1 12.28,45.09 12.28,45.12 12.28,45.72 | 12.28,45.72 CC10.2
N$25
  Top 0.254: RC6.2 CC6.1 10.58,43.18 | CC9.2 10.58,43.18 | IC3.20 15.01,39.6 13.97,40.64 13.97,42.54 13.34,43.18 10.58,43.18
N$26
  Top 0.254: IC3.13 24.55,40.6 24.13,41.02 24.13,42.54 | C62.2 24.13,43.9 24.13,42.54 | 24.13,42.54 20.57,42.54 19.68,43.43 19.68,45.09 15.24,49.53 5.71,49.53 4.45,50.8 TS1.1
N$27
  Top 0.254: Q1.1 38.59,38.73 39.37,38.73 39.88,39.24 39.88,40.51 40.39,41.02 R20.2
N$28
  Top 0.254: IC3.8 33.34,38.1 C10.1
N$29
  Top 0.254: D5.C 39.59,32.17 R1.2 R2.1
N$30
  Top 0.254: IC3.7 31.2,37.6 C14.1
N$31
  Top 0.254: IC3.6 28.96,37.1 | 28.96,37.1 29.54,37.1 R21.2 | 28.96,37.1 28.96,34.29 31.08,32.17 R22.2
N$32
  Top 0.254: U$2.4 27.81,30.23 | 27.81,30.23 U$2.3 | R22.1 27.81,30.23
N$33
  Top 0.254: IC3.29 18.84,35.1 18.41,34.67 18.41,33.91 18.8,33.53 19.94,33.53 20.57,32.89 20.57,31.79 C42.2 22.01,31.75 C41.1 R42.2
N$34
  Top 0.254: R41.1 19.81,27.94 19.18,27.3 17.78,27.3 11.05,20.57 2.67,20.57 JP1.2
N$35
  Top 0.254: R42.1 22.23,27.81 21.08,26.67 18.16,26.67 11.43,19.94 4.7,19.94 2.67,17.91 JP1.1
N$36
  Top 0.254: Q2.1 21.05,15.56 | 21.05,15.56 R30.1 | R28.2 21.05,14.21 21.05,15.56
N$37
  Top 0.254: R31.2 19.05,11.75 | 19.05,11.75 R29.1 | Q3.1 19.05,11.75
N$38
  Top 0.254: Q4.8 4.7,12.7 4.7,13.97 | 4.7,13.97 Q4.7 | Q4.6 4.7,15.24 | 4.7,15.24 4.7,13.97 | Q4.5 4.7,16.51 4.7,15.37 4.7,15.24 | 4.7,15.24 4.7,12.83 MCB.4
N$39
  Top 0.254: D1.C D2.C 13.46,6.48 R15.2
N$40  (via drill 0.35)
  Top 0.254: R10.1 Q3.3 | Q3.3 | U$3.1 17.61,19.9 17.4,19.68 v17.4,19.56 | Q4.2 13.72,13.97 v13.97,14.22 14.39,13.8 Q3.3
  Bottom 0.254: v17.4,19.56 13.97,16.13 v13.97,14.22
N$41
  Top 0.152: GEN_ERR_RED.C 44.45,21.21 45.68,19.98 R14.2
N$42
  Top 0.152: OC_SC_RED.C 44.96,19.3 45.59,18.67 46.57,18.67 R13.2
N$43
  Top 0.152: UV_OV_RED.C 42.16,17.4 45.68,13.88 R12.2
N$44
  Top 0.152: OK_GRN.C 43.94,23.11 45.59,24.77 46.57,24.77 R11.2
N$45  (via drill 0.35)
  Top 0.254: IC1.14 38.02,24.77 41.91,24.77 v42.16,24.51
  Bottom 0.254: v42.16,24.51 42.16,13.59 39.37,10.79 UART1.2
N$46  (via drill 0.35)
  Top 0.254: IC1.13 39.01,23.89 39.24,24.13 v40.89,24.13
  Bottom 0.254: v40.89,24.13 40.89,14.22 36.83,10.16 UART1.1
REGSRC
  Top 0.254: C31.2 36.52,41.17 Q1.2 36.48,38.6 IC3.9
RES  (via drill 0.35)
  Top 0.254: IC1.29 26.91,23.09 24.77,20.96 24.77,15.03 | 24.77,15.03 24.77,13.66 25.48,12.95 29.5,12.95 30.35,13.8 C11.1 31.92,13.8 32.38,13.34 32.38,12.07 33.02,11.43 v42.55,11.43 | R4.1 24.77,15.03
  Bottom 0.254: ISP.5 46.1,26.42 43.18,23.5 43.18,12.07 v42.55,11.43
SCK
  Top 0.254: IC1.17 42.44,27.79 ISP.3
SCL
  Top 0.254: IC3.5 27.54,36.6 27.94,36.2 27.94,34.42 30.23,32.13 30.23,26.92 30.73,26.42 30.73,24.13 30.48,23.88 29.38,23.88 IC1.28 25.16,23.89 23.5,22.23 R8.2
SDA
  Top 0.254: IC3.4 26.89,36.1 27.3,35.69 27.3,34.29 26.8,33.78 26.8,24.7 | R5.2 21.46,22.1 24.06,24.7 26.8,24.7 | 26.8,24.7 IC1.27
TRIP_MCB
  Top 0.254: Q4.4 Q2.3 R25.1 16.51,21.3 16.51,21.82 U$3.2
UB_MCB
  Top 0.254: MCB.3 2.41,10.16 D1.A 9.53,10.16 10.79,11.43 12.95,11.43 13.34,11.05 13.34,8.38 13.72,8 15.49,8 16.09,8.6 R10.2 16.09,10.33 15.49,10.92 15.49,18.58 R25.2
  Top 1.016: MCB.2 MCB.3
UB_UNPROT
  Top 0.254: U$1.4 U$1.3 4.7,5.21 MCB.1
VC5X  (via drill 0.35)
  Top 0.254: CC5B.1 CC6.2 | C1.2 41.59,39.69 41.78,39.88 43.05,39.88 43.4,40.22 R20.1 43.4,41.82 43.18,42.04 41.78,42.04 41.59,42.22 C4.1 36.07,43.31 34.92,42.16 34.92,40 34.67,39.75 v31.5,39.75 | RF1.2 CC5B.1 | CC5B.1 v13.59,39.37 | C61.2 30.86,40.39 v31.5,39.75 | IC3.10 30.84,39.1 v31.5,39.75 | C62.1 25.87,42.71 v25.91,42.67 | v7.87,24.13 D4.C
  Bottom 0.254: 25.91,39.37 v13.59,39.37 6.35,39.37 | 25.91,39.37 31.11,39.37 v31.5,39.75 | v7.87,24.13 5.84,26.16 5.84,35.69 6.35,36.2 6.35,39.37 | v25.91,42.67 25.91,39.37 | TS1.2 4.45,53.34 5.08,52.7 5.08,43.18 6.35,41.91 6.35,39.37
VC10X
  Top 0.254: R3.2 43.4,38.63 C1.1 44.45,38.73 45.34,39.62 45.34,44.32 44.83,44.83 36.58,44.83 33.34,41.6 27.94,41.6 | IC3.15 27.94,41.6 | D3.C 21.71,45.21 22.23,45.72 26.92,45.72 27.94,44.7 27.94,41.6
X1
  Top 0.254: Y1.1 34.67,13.12 | 34.67,13.12 C5.2 | IC1.7 35.66,17.88 34.67,16.89 34.67,13.12
X2
  Top 0.254: C6.2 Y1.3 37.93,16.3 36.45,17.77 IC1.8

### Text on the board
tValues: TEMP | BMS 7s V1.1 / (c) Ludwig Bre / 04/2021 | B7 | 1 | . | B0 | BOOT | + | SHNT / G B L | 1 | . | + | OK / VOL / CUR / ERR | A- | 1 | . | . | A+ | TX RX G | MCB / OU IN | RES | TX RX DTR G